# EAGLE design nRF24L01_ESP (EAGLE 7.5.0)
Assembly variants: <unbenannt>
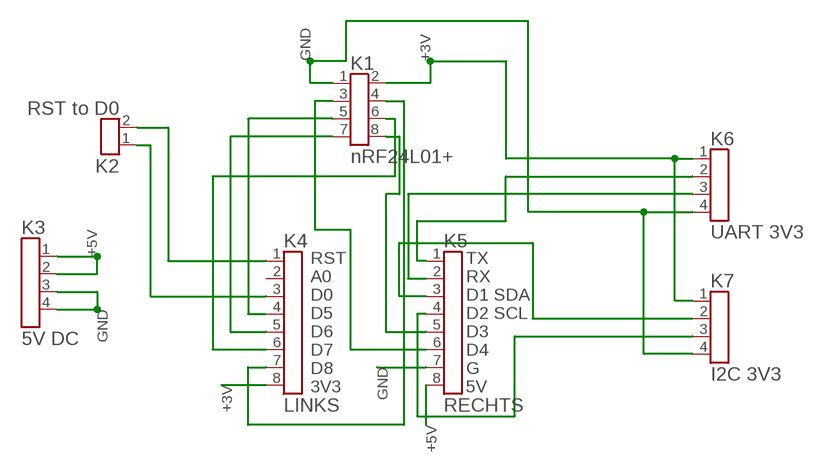
[diagram p0: schematic, sheet 1]

## Parts
K1  nRF24L01+  STIFTLEISTE_2X04_G_2,54_0  [STIFTLEISTE_2X04_G_2,54_0]
K2  RST to D0  STIFTLEISTE_1X02_G_2,54_10  [STIFTLEISTE_1X02_G_2,54_10]
K3  5V DC  KLEMME4POL_3  [KLEMME4_3]
K4  LINKS  STIFTLEISTE_1X08_G_2,54_4  [STIFTLEISTE_1X08_G_2,54_4]
K5  RECHTS  STIFTLEISTE_1X08_G_2,54_5  [STIFTLEISTE_1X08_G_2,54_5]
K6  UART 3V3  STIFTLEISTE_1X04_G_2,54_11  [STIFTLEISTE_1X04_G_2,54_11]
K7  I2C 3V3  STIFTLEISTE_1X04_G_2,54_13  [STIFTLEISTE_1X04_G_2,54_13]

## Nets
+3V: K1.2 K4.8 K6.1 K7.1
+5V: K3.1 K3.2 K5.8
GND: K1.1 K3.3 K3.4 K5.7 K6.4 K7.4
SIG$46: K1.3 K5.6
SIG$47: K1.5 K4.4
SIG$48: K1.7 K4.5
SIG$49: K1.4 K4.7
SIG$50: K1.6 K4.6
SIG$51: K1.8 K5.5
SIG$57: K2.2 K4.1
SIG$58: K2.1 K4.3
SIG$59: K5.1 K6.2
SIG$60: K5.2 K6.3
SIG$64: K5.3 K7.2
SIG$65: K5.4 K7.3
Unconnected: K4.2

## Notes on the sheet
- RST | TX
- A0 | RX
- D0 | D1 SDA
- D5 | D2 SCL
- D6 | D3
- D7 | D4
- D8 | G
- 3V3 | 5V

## Library data of the parts
K1 = TARGET3001!_V30.8.0.19:STIFTLEISTE_2X04_G_2,54_0: Stiftleiste
K2 = TARGET3001!_V30.8.0.19:STIFTLEISTE_1X02_G_2,54_10: Stiftleiste
K3 = TARGET3001!_V30.8.0.19:KLEMME4POL_3: Schraubklemme 4-polig RM5,08
K4 = TARGET3001!_V30.8.0.19:STIFTLEISTE_1X08_G_2,54_4: Stiftleiste
K5 = TARGET3001!_V30.8.0.19:STIFTLEISTE_1X08_G_2,54_5: Stiftleiste
K6 = TARGET3001!_V30.8.0.19:STIFTLEISTE_1X04_G_2,54_11: Stiftleiste
K7 = TARGET3001!_V30.8.0.19:STIFTLEISTE_1X04_G_2,54_13: Stiftleiste

## Board
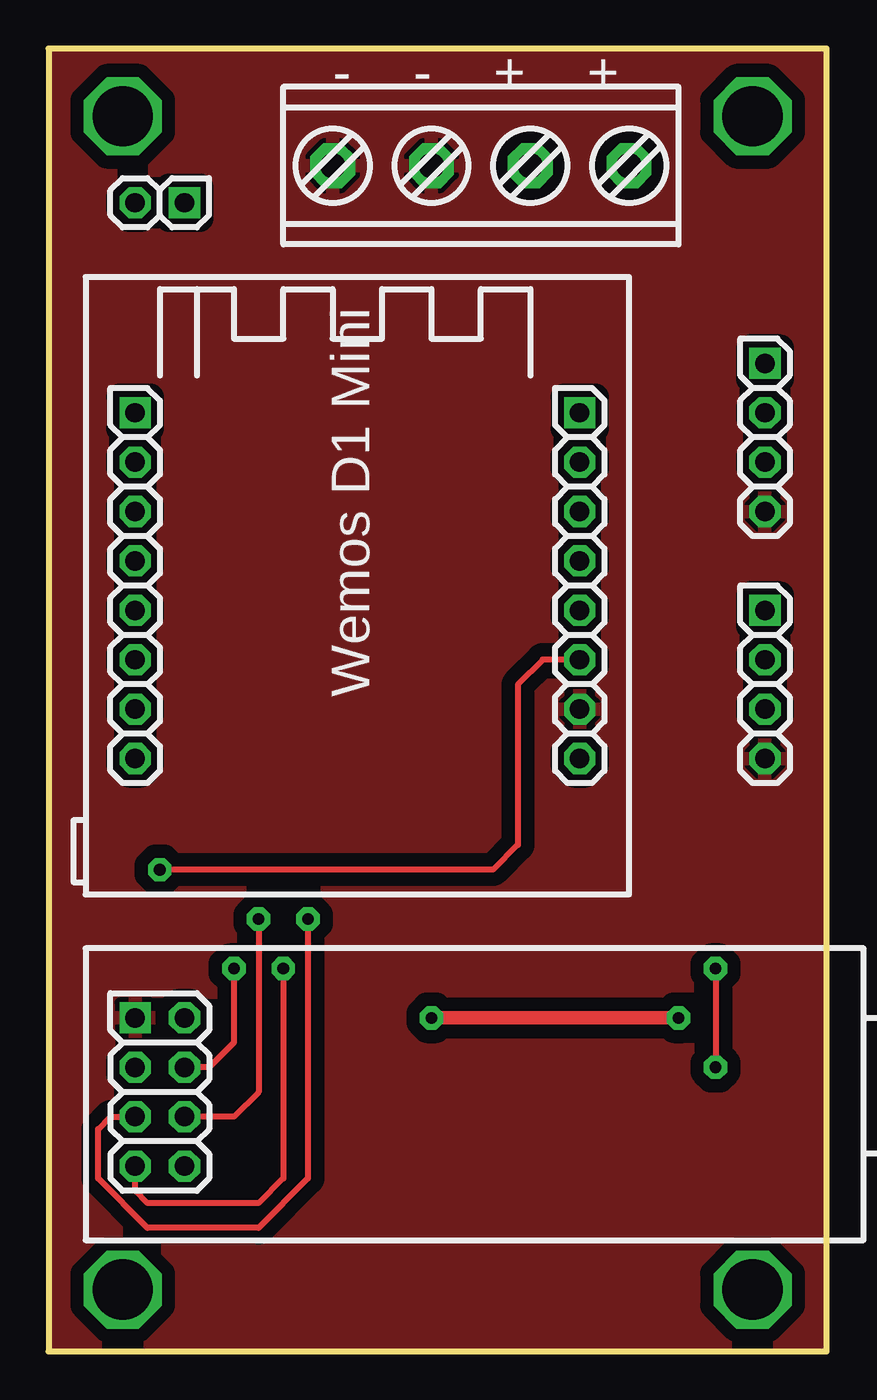
[diagram p1: board, top side]
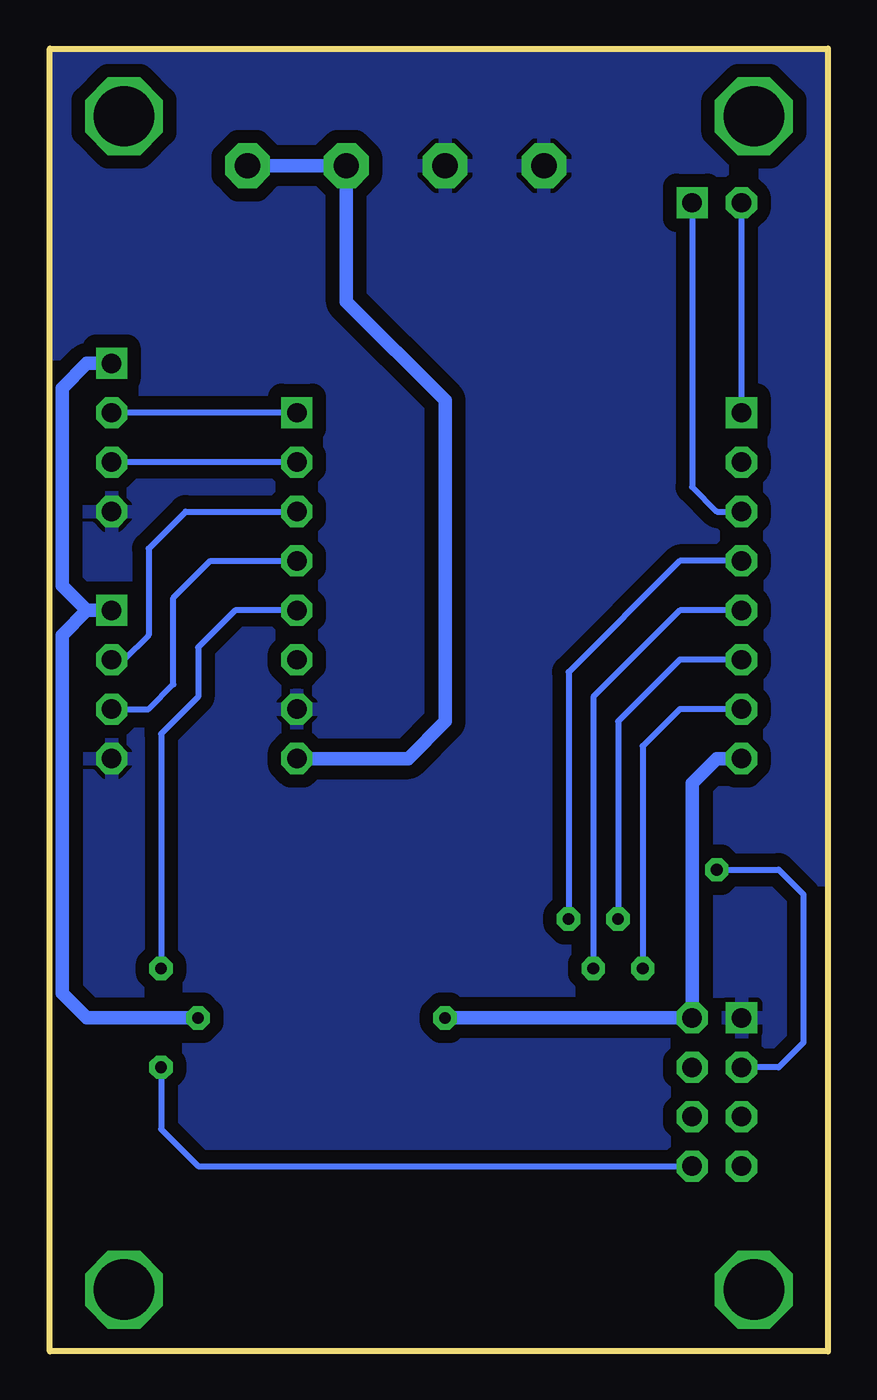
[diagram p2: board, bottom side, seen from below]

Size 40.01 x 66.98 mm. Coordinates in mm from the lower left corner, seen from the top.
Outline: 0,0 40.01,0 40.01,66.98 0,66.98 0,0
Copper layers (1*16): Top 0.035mm / dielectric 1.5mm / Bottom 0.035mm
Design rules "TARGET3001!": minimum track width 0.2mm, minimum drill 0.6mm, track to track 0.2mm, track to pad 0.2mm, pad to pad 0.2mm, via to via 0.2mm, smd to smd 0.2mm, copper to edge 0mm, drill to drill 0.3mm, minimum pad ring 0.3mm, minimum via ring 0.3mm, stop-mask expansion 4mil, vias tented up to drill 0mil, thermal gap 10mil

### Footprints (pad centres in the part's own frame; a part is rotated, then mirrored left to right if it is on the bottom)
STIFTLEISTE_2X04_G_2,54_0 = drill 1 pad 1.6 square: 1 0,0 | drill 1 pad 1.6 octagon: 2 0,2.54; 3 2.54,0; 4 2.54,2.54; 5 5.08,0; 6 5.08,2.54; 7 7.62,0; 8 7.62,2.54
STIFTLEISTE_1X02_G_2,54_10 = drill 1 pad 1.6 square: 1 0,0 | drill 1 pad 1.6 octagon: 2 2.54,0
KLEMME4_3 = drill 1.3 pad 2.3 octagon: 1 -7.62,0; 2 -2.54,0; 3 2.54,0; 4 7.62,0
STIFTLEISTE_1X08_G_2,54_4 = drill 1 pad 1.6 square: 1 0,0 | drill 1 pad 1.6 octagon: 2 2.54,0; 3 5.08,0; 4 7.62,0; 5 10.16,0; 6 12.7,0; 7 15.24,0; 8 17.78,0
STIFTLEISTE_1X08_G_2,54_5 = drill 1 pad 1.6 square: 1 0,0 | drill 1 pad 1.6 octagon: 2 2.54,0; 3 5.08,0; 4 7.62,0; 5 10.16,0; 6 12.7,0; 7 15.24,0; 8 17.78,0
STIFTLEISTE_1X04_G_2,54_11 = drill 1 pad 1.6 square: 1 0,0 | drill 1 pad 1.6 octagon: 2 2.54,0; 3 5.08,0; 4 7.62,0
STIFTLEISTE_1X04_G_2,54_13 = drill 1 pad 1.6 square: 1 0,0 | drill 1 pad 1.6 octagon: 2 2.54,0; 3 5.08,0; 4 7.62,0

### Placement (x,y rotation side)
K1  4.45,17.14 270 top
K2  6.99,59.05 180 top
K3  22.23,60.96 180 top
K4  4.45,48.26 270 top
K5  27.3,48.26 270 top
K6  36.83,50.8 270 top
K7  36.83,38.1 270 top

### Tracks (layer width: path | path; a pad name or v marks a point on that pad's centre or on a via)
+3V  (via drill 0.6 pad 1.2)
  Top 0.7: v19.68,17.14 v32.38,17.14
  Bottom 0.7: K4.8 5.71,30.48 6.99,29.21 K1.2 v19.68,17.14 | 38.1,38.1 39.37,36.83 39.37,18.41 38.1,17.14 v32.38,17.14 | K6.1 38.1,50.8 39.37,49.53 39.37,39.37 38.1,38.1 | 38.1,38.1 K7.1
+5V
  Bottom 0.7: K5.8 21.59,30.48 19.68,32.38 19.68,48.9 24.77,53.98 K3.2 K3.1 | K3.1
GND
  pour Top (isolate 0.7): 39.66,66.63 0.35,66.63 0.35,0.35 39.66,0.35 39.66,66.63
  pour Bottom (isolate 0.7): 39.66,66.63 0.35,66.63 0.35,0.35 39.66,0.35 39.66,66.63
SIG$46  (via drill 0.6 pad 1.2)
  Top 0.3: v5.71,24.76 22.86,24.76 24.13,26.03 24.13,34.29 25.4,35.56 K5.6
  Bottom 0.3: v5.71,24.76 2.54,24.76 1.27,23.49 1.27,15.88 2.54,14.6 K1.3
SIG$47  (via drill 0.6 pad 1.2)
  Top 0.3: v13.34,22.22 13.34,8.89 10.79,6.35 5.08,6.35 2.54,8.89 2.54,11.43 3.17,12.06 K1.5
  Bottom 0.3: K4.4 7.62,40.64 13.34,34.92 v13.34,22.22
SIG$48  (via drill 0.6 pad 1.2)
  Top 0.3: v12.06,19.68 12.06,8.89 10.79,7.62 5.08,7.62 4.45,8.25 K1.7
  Bottom 0.3: K4.5 7.62,38.1 12.06,33.65 v12.06,19.68
SIG$49  (via drill 0.6 pad 1.2)
  Top 0.3: v9.53,19.68 9.53,15.88 8.26,14.6 K1.4
  Bottom 0.3: K4.7 7.62,33.02 9.53,31.12 v9.53,19.68
SIG$50  (via drill 0.6 pad 1.2)
  Top 0.3: v10.79,22.22 10.79,13.33 9.53,12.06 K1.6
  Bottom 0.3: K4.6 7.62,35.56 10.79,32.38 v10.79,22.22
SIG$51  (via drill 0.6 pad 1.2)
  Top 0.3: v34.29,19.68 v34.29,14.6
  Bottom 0.3: K5.5 30.48,38.1 32.38,36.2 32.38,33.65 34.29,31.75 v34.29,19.68 | v34.29,14.6 34.29,11.43 32.38,9.52 K1.8
SIG$57
  Bottom 0.3: K4.1 K2.2
SIG$58
  Bottom 0.3: K2.1 6.99,44.45 5.71,43.18 K4.3
SIG$59
  Bottom 0.3: K5.1 K6.2
SIG$60
  Bottom 0.3: K5.2 K6.3
SIG$64
  Bottom 0.3: K7.2 36.2,35.56 34.92,36.83 34.92,41.27 33.02,43.18 K5.3
SIG$65
  Bottom 0.3: K7.3 34.92,33.02 33.66,34.29 33.66,38.73 31.75,40.64 K5.4
WITHOUT_SIGNAL  (via drill 3.1 pad 4)
  other vias: 3.81,3.17 36.2,3.17 3.81,63.5 36.2,63.5

### Text on the board
tPlace: - - + + | Wemos D1 Mini